# EAGLE design pira-badge-attiny3 (EAGLE 8.7.1)
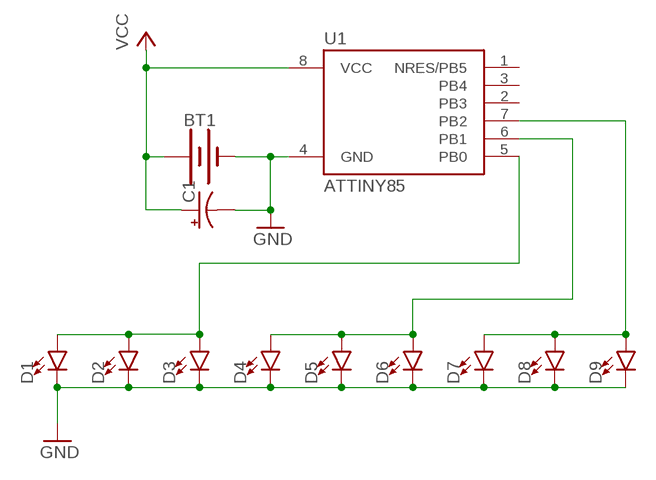
[diagram p0: schematic, sheet 1]

## Parts
BT1  BATTERY-24.5MM_PTH  [BATTCON_24.5MM_PTH]
C1  CPOL-USCT3216  [CT3216]
D1  LED1206  [LED-1206]
D2  LED1206  [LED-1206]
D3  LED1206  [LED-1206]
D4  LED1206  [LED-1206]
D5  LED1206  [LED-1206]
D6  LED1206  [LED-1206]
D7  LED1206  [LED-1206]
D8  LED1206  [LED-1206]
D9  LED1206  [LED-1206]
U1  ATTINY85  ATTINY85-20S  [SOIC8_EIAJ_208MIL]

## Nets
GND: BT1.2(-) C1.- D1.C D2.C D3.C D4.C D5.C D6.C D7.C D8.C D9.C U1.4(GND)
N$1: D7.A D8.A D9.A U1.7(PB2)
N$2: D1.A D2.A D3.A U1.5(PB0)
N$4: D4.A D5.A D6.A U1.6(PB1)
VCC: BT1.3(+) C1.+ U1.8(VCC)
Unconnected: U1.1(NRES/PB5) U1.2(PB3) U1.3(PB4)

## Library data of the parts
BT1 = SparkFun-Batteries:BATTERY: Battery - Single Cell A variety of battery chemistries, sizes, and footprints. Device List: 20MM_PTH - Coin Cell Battery Holder - 20mm (PTH) <https://www.sparkfun.com/products/783> 6.8MM_PTH - Coin Cell Battery Holder - 6.8MM(SMD) <https://www.digikey.com/product-detail/en/seiko-instruments/MS621FE-FL11E/728-1057-ND/1889208?WT.srch=1&gclid=CNOQ5a6LzdQCFZS2wAodXCkE0g> 12MM_SMD - Coin Cell Battery Holder - 12mm (SMD) <https://www.sparkfun.com/products/10592> 12MM_PTH - Coin Cell Battery Holder - 12mm (PTH) <https://www.sparkfun.com/products/7948> 20MM_SMD - 20mm Coin Cell Battery Holder (SMD) (2 legs) Used on the Big Time Watch Kit <https://www.sparkfun.com/products/11734> 20MM_SMD_4LEGS - Coin Cell Battery Holder - 20mm (SMD) <https://www.sparkfun.com/products/11892> 20MM_SMD_4LEGS_OVERPASTE - Coin Cell Battery Holder - 20mm (SMD) <https://www.sparkfun.com/products/11892> (Over-paste on the legs) 24.5MM_PTH - Coin Cell Battery Holder - 24.5mm (PTH) <https://www.sparkfun.com/products/8863> 9V - 9V Battery Holder - PC Mount Used on the SparkFun SparkPunk Sound Kit <https://www.sparkfun.com/products/11177> and SparkFun SparkPunk Sequencer Kit <https://www.sparkfun.com/products/12707> 18650 - Battery Holder - 18650 (PTH) <https://www.sparkfun.com/products/13113> AA - Battery Holder - 1xAA (PTH) <https://www.sparkfun.com/products/7949> AAA - Battery Holder - 1xAAA (PTH) <https://www.sparkfun.com/products/12718> AA_KIT - Battery Holder - 1xAA (PTH) <https://www.sparkfun.com/products/7949> Special kit package - pads only have exposed copper on one side of the board. AAA_KIT - Battery Holder - 1xAAA (PTH) <https://www.sparkfun.com/products/12718> Special kit package - pads only have exposed copper on one side of the board.; SF_SKU: PRT-08863
C1 = rcl:CPOL-US: POLARIZED CAPACITOR, American symbol; SPICEPREFIX: C
D1-D9 = SparkFun-LED:LED: LED (Generic) Standard schematic elements and footprints for 5mm, 3mm, 1206, and 0603 sized LEDs. Generic LEDs with no color specified.
U1 = _hhn_attiny25_45_85:ATTINY85*: ATMEL ATtiny 85 Packages: P = PDIP 08 30mil S = SOIC 08 EIAJ 208mil Technologies Note: for complete ordering code (temp. range, finish, tape&reel etc.) see www.atmel.com • Supply Voltage: V = (1.8…5.5)V | [blank] = (2.7…5.5)V • Speed: 10 = 10 MHz | 20 = 20 MHz Author: Dipl.-Ing. FH Rainer Bayer HHN Hochschule Heilbronn (Heilbronn University), rainer.bayer@hs-heilbronn.de Ingenieurbüro ing-rb, mail@ing-rb.de

## Board
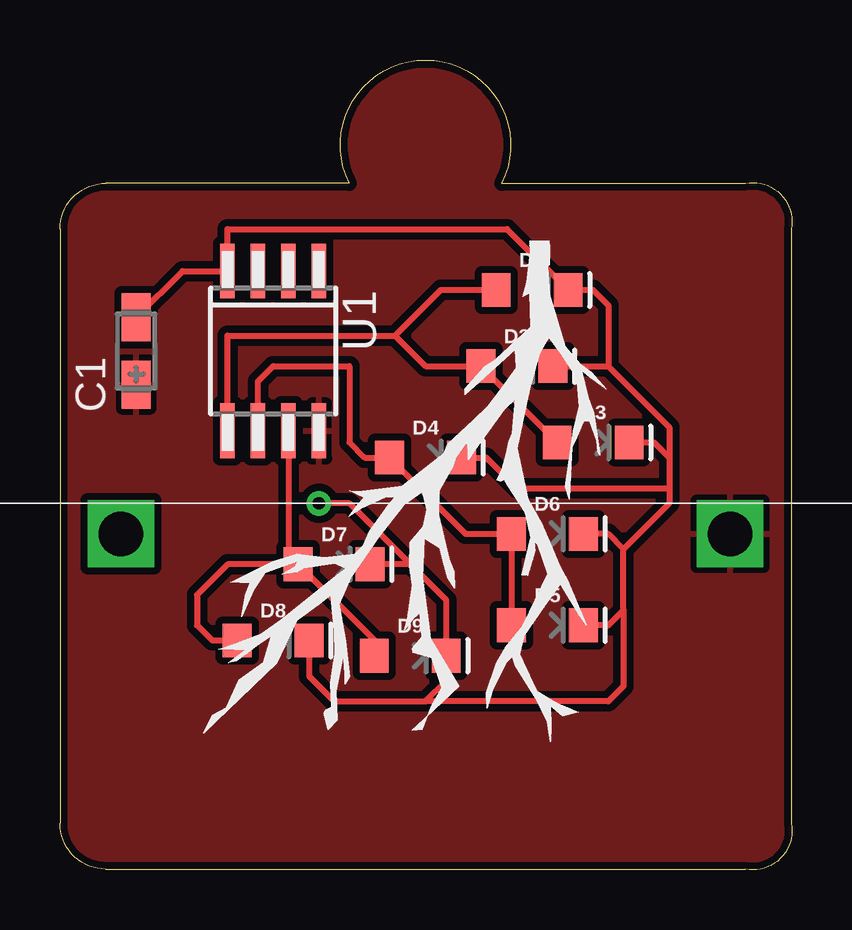
[diagram p1: board, top side]
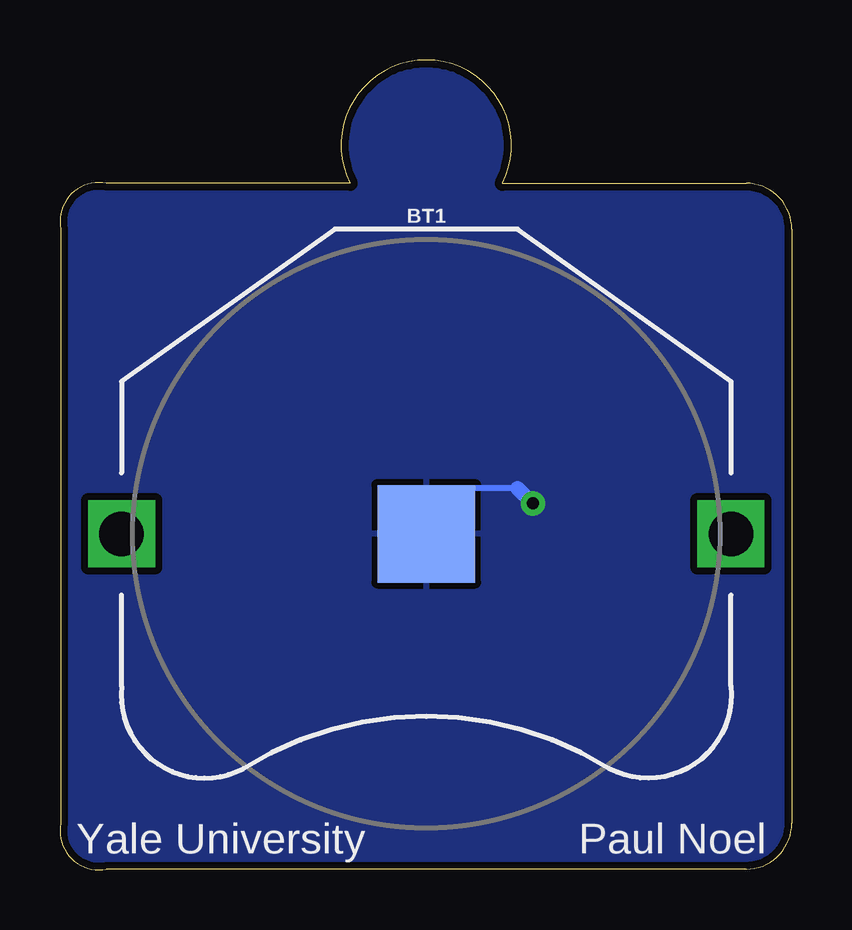
[diagram p2: board, bottom side, seen from below]

Size 30.51 x 33.74 mm. Coordinates in mm from the lower left corner, seen from the top.
Outline: 1.9,0.03 28.57,0.03 arc113 30.48,1.94 30.48,26.7 arc113 28.57,28.61 18.41,28.61 arc233 12.07,28.61 1.9,28.61 arc90 0,26.7 0,1.94 arc90 1.9,0.03
Copper layers (1*16): Top 0.035mm / dielectric 1.5mm / Bottom 0.035mm
Design rules "SparkFun": minimum track width 8mil, minimum drill 20mil, track to track 8mil, track to pad 8mil, pad to pad 8mil, via to via 8mil, smd to smd 8mil, copper to edge 8mil, drill to drill 8mil, minimum pad ring 12mil, minimum via ring 10mil, stop-mask expansion 4mil, vias tented up to drill 20mil, thermal gap 10mil

### Footprints (pad centres in the part's own frame; a part is rotated, then mirrored left to right if it is on the bottom)
BATTCON_24.5MM_PTH = drill 1.854 square: 1 -12.7,0; 3 12.7,0 | smd 4.064 x 4.064: 2 0,0
CT3216 = smd 2 x 1.2: + -1.4,0; - 1.4,0
LED-1206 = smd 1.2 x 1.4: A -1.5,0; C 1.5,0
SOIC8_EIAJ_208MIL = smd 0.6 x 2.286: 1 -1.905,-3.33; 2 -0.635,-3.33; 3 0.635,-3.33; 4 1.905,-3.33; 5 1.905,3.33; 6 0.635,3.33; 7 -0.635,3.33; 8 -1.905,3.33

### Placement (x,y rotation side)
BT1  15.24,14 180 bottom
C1  3.18,21.62 90 top
D1  19.68,24.16 0 top
D2  19.05,20.99 0 top
D3  22.23,17.81 0 top
D4  15.24,17.18 0 top
D5  20.32,10.19 0 top
D6  20.32,14 0 top
D7  11.43,12.73 0 top
D8  8.89,9.56 0 top
D9  14.61,8.92 0 top
U1  8.89,21.62 180 top

### Tracks (layer width: path | path; a pad name or v marks a point on that pad's centre or on a via)
GND  (via drill 0.51)
  Top 0.254: 23.5,10.83 22.86,10.19 D5.C | 23.5,10.83 23.5,13.37 | 23.5,13.37 22.86,14 D6.C | D3.C 24.77,17.81 25.4,17.18 | 25.4,17.18 25.4,15.91 | 25.4,15.91 25.4,15.27 23.5,13.37 | 22.86,20.99 25.4,18.45 25.4,17.18 | D2.C 22.86,20.99 | 22.86,20.99 22.86,23.53 22.23,24.16 D1.C 18.64,26.7 6.99,26.7 U1.4 5.11,24.95 C1.- 3.05,22.89 | v10.79,15.27 12.07,15.27 14.61,12.73 | D8.C 10.39,8.06 11.43,7.02 15.24,7.02 | 15.24,7.02 16.11,7.88 D9.C 16.11,11.23 14.61,12.73 | 14.61,12.73 D7.C | D4.C 17.78,17.18 19.05,15.91 25.4,15.91 | 23.5,10.83 23.5,7.65 22.86,7.02 15.24,7.02
  Bottom 0.254: 11.43,15.91 13.97,15.91 13.97,15.27
  Bottom 0.61: v10.79,15.27 11.43,15.91
  pour Bottom (isolate 0.305): -1.27,33.69 40.64,33.69 40.64,-1.87 -1.27,-1.87
N$1
  Top 0.254: U1.7 9.53,13.14 D7.A | D8.A 6.35,9.56 5.71,10.19 5.71,11.46 6.99,12.73 D7.A | D7.A 13.11,9.56 D9.A
N$2
  Top 0.254: U1.5 6.99,22.26 13.97,22.26 | 13.97,22.26 15.88,24.16 D1.A | 13.97,22.26 15.24,20.99 D2.A D3.A
N$4
  Top 0.254: U1.6 8.26,20.35 8.89,20.99 12.07,20.99 12.07,17.81 12.7,17.18 D4.A 16.91,14 D6.A D5.A
VCC
  pour Top (isolate 0.305): -1.27,36.23 33.02,36.23 33.02,-0.6 -0.64,-0.6

### Text on the board
bPlace: Paul Noel | Yale University
tStop: AAPT 2018 | P | I | R | A
tRestrict: AAPT 2018
bRestrict: Paul Noel | Yale University